# Altium schematic sheet Module.SchDoc
size A4; SheetNumber: 7; SheetTotal: 7
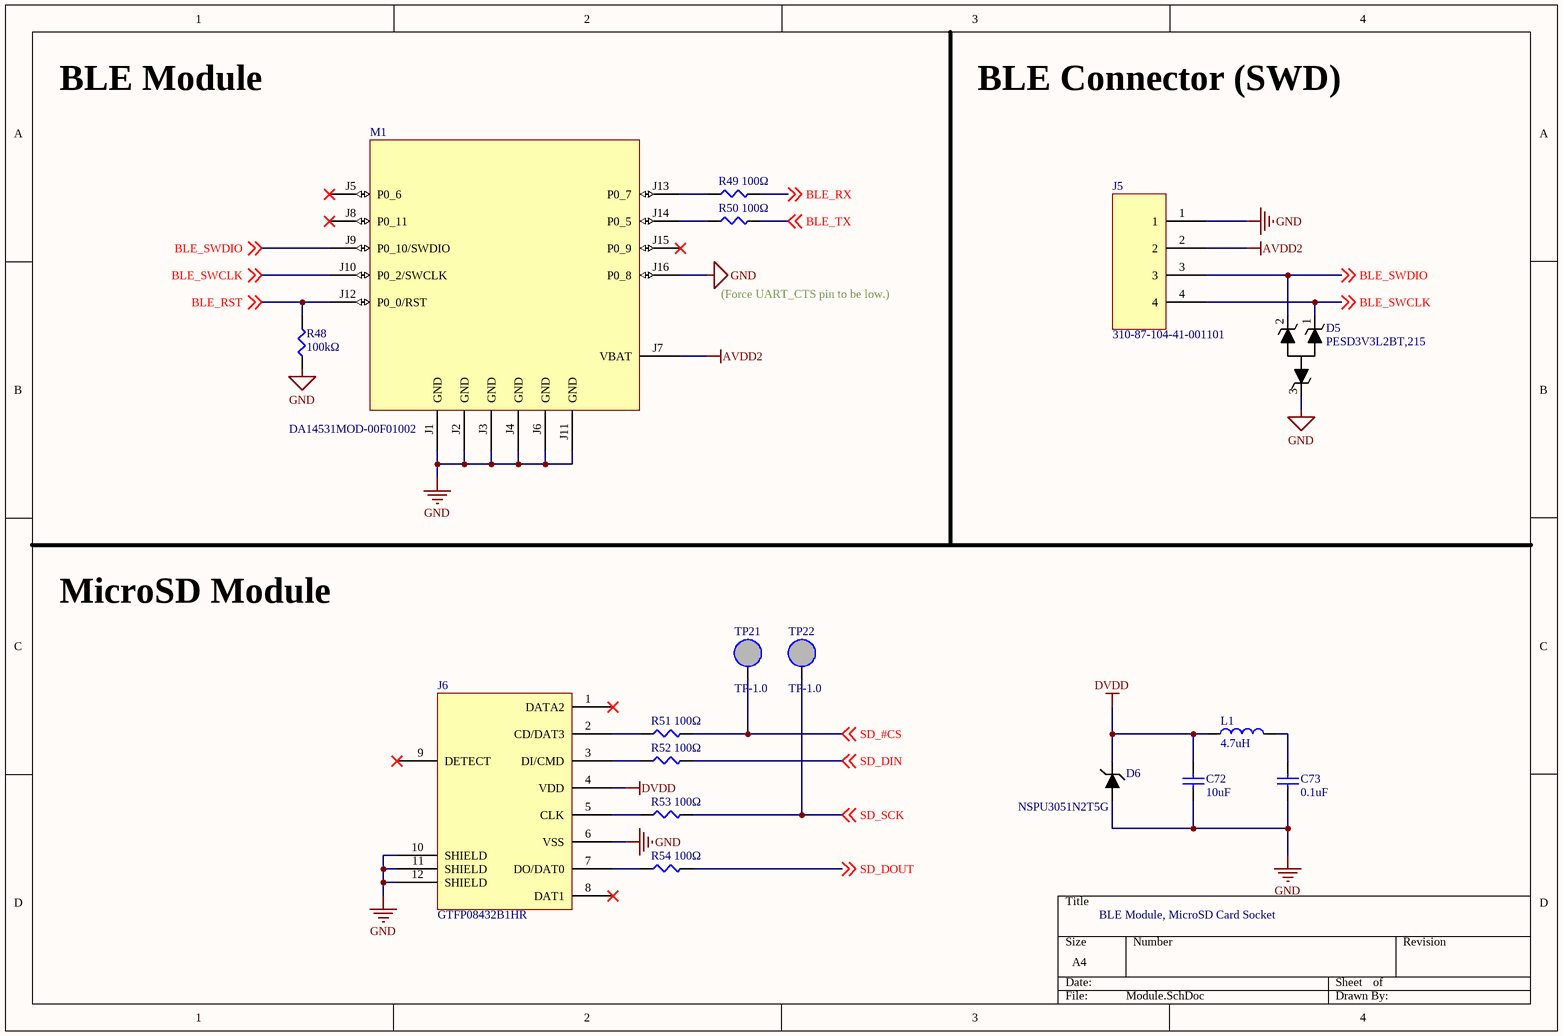
[diagram p0: Module.SchDoc]

## Parts
C72  10uF  [0603]
C73  0.1uF  [0402]
D5  PESD3V3L2BT,215  [SOT-23-3]
D6  NSPU3051N2T5G  [X2DFN-2(0.73-0.6x1.0x0.37)]
J5  310-87-104-41-001101  [4Pos, 1Row]
J6  GTFP08432B1HR  [microSD_Card_slot]
L1  4.7uH  [3.2 mm x 2.5 mm x 1 mm]
M1  DA14531MOD-00F01002  [DA14531MOD-00F01002]
R48  100kΩ  [0402]
R49  100Ω  [0402]
R50  100Ω  [0402]
R51  100Ω  [0402]
R52  100Ω  [0402]
R53  100Ω  [0402]
R54  100Ω  [0402]
TP21  TP-1.0  [Testpoint]  (no BOM)
TP22  TP-1.0  [Testpoint]  (no BOM)

## Nets
AVDD2: J5.2 M1.J7(VBAT)
DVDD: C72.2 D6.1(CATHODE) J6.4(VDD) L1.1
GND: C72.1 C73.1 D5.3 D6.2(ANODE) J5.1 J6.6(VSS) J6.10(SHIELD) J6.11(SHIELD) J6.12(SHIELD) M1.J1(GND) M1.J2(GND) M1.J3(GND) M1.J4(GND) M1.J6(GND) M1.J11(GND) M1.J16(P0_8) R48.1
BLE_RST: M1.J12(P0_0/RST) R48.2 ; off-sheet BLE_RST
BLE_RX: R49.2 ; off-sheet BLE_RX
BLE_SWCLK: D5.1 J5.4 M1.J10(P0_2/SWCLK) ; off-sheet BLE_SWCLK
BLE_SWDIO: D5.2 J5.3 M1.J9(P0_10/SWDIO) ; off-sheet BLE_SWDIO
BLE_TX: R50.2 ; off-sheet BLE_TX
SD_#CS: R51.2 TP21.1 ; off-sheet SD_#CS
SD_DIN: R52.2 ; off-sheet SD_DIN
SD_DOUT: R54.2 ; off-sheet SD_DOUT
SD_SCK: R53.2 TP22.1 ; off-sheet SD_SCK
NetC73_2: C73.2 L1.2
NetJ6_2: J6.2(CD/DAT3) R51.1
NetJ6_3: J6.3(DI/CMD) R52.1
NetJ6_5: J6.5(CLK) R53.1
NetJ6_7: J6.7(DO/DAT0) R54.1
NetM1_J13: M1.J13(P0_7) R49.1
NetM1_J14: M1.J14(P0_5) R50.1

Not connected (* = marked no-connect by the designer): J6 1(DATA2)* 8(DAT1)* 9(DETECT)*; M1 J5(P0_6)* J8(P0_11)* J15(P0_9)*

## Notes on the sheet
- BLE Module
- BLE Connector (SWD)
- (Force UART_CTS pin to be low.)
- MicroSD Module
- BLE Module, MicroSD Card Socket

## Library data of the parts
C72 = 0603: MLCC-0603
C73 = 0402: MLCC-0402
D5 = PESD3V3L2BT,215: ESD Suppressors / TVS Diodes, 2 Channl. Breakdown 6.4V, Clamping Voltage 8V
D6 = NSPU3051N2T5G: 0016-11-ESD-01-D3V3F4U10LP-7; AuthorBy: yjlab
J5 = 310-87-104-41-001101: Headers & Wire Housings, Through Hole, 4 Poisition, 1 Row, Straight, Pitch 2.54 mm
J6 = GTFP08432B1HR: 0023-23-MMC-02-GTFP08432B1HR
L1 = SRP3212: SRP3212 Series Shielded Power Inductors, Wirewound
M1 = DA14531MOD-00F01002: 0038-15-BLT-07-DA14531MOD-00F01002
R48-R54 = 0402: Resistor_SMD_0402; AuthorBy: yjlab
TP21 TP22 = Testpoint